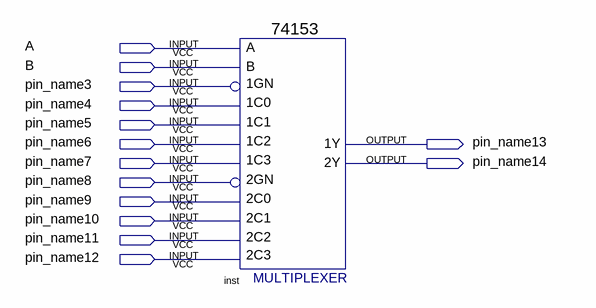
[diagram p0: schematic sheet]
// Quartus schematic a74153a.bdf as structural Verilog: 1 symbols, 14 pins
module a74153a (
  input  A,
  input  B,
  input  pin_name3,
  input  pin_name4,
  input  pin_name5,
  input  pin_name6,
  input  pin_name7,
  input  pin_name8,
  input  pin_name9,
  input  pin_name10,
  input  pin_name11,
  input  pin_name12,
  output pin_name13,
  output pin_name14
);

  \74153  inst (
    .\1C1 (pin_name5), .\1GN (pin_name3), .\1C0 (pin_name4), .\2C0 (pin_name9), .\2GN (pin_name8),
    .\2C2 (pin_name11), .\1C2 (pin_name6), .\1C3 (pin_name7), .B(B), .A(A), .\2C1 (pin_name10),
    .\2C3 (pin_name12), .\1Y (pin_name13), .\2Y (pin_name14));
endmodule
